# Altium schematic sheet QCLogic Rev A Sht1 MCU IO.SchDoc
size A3
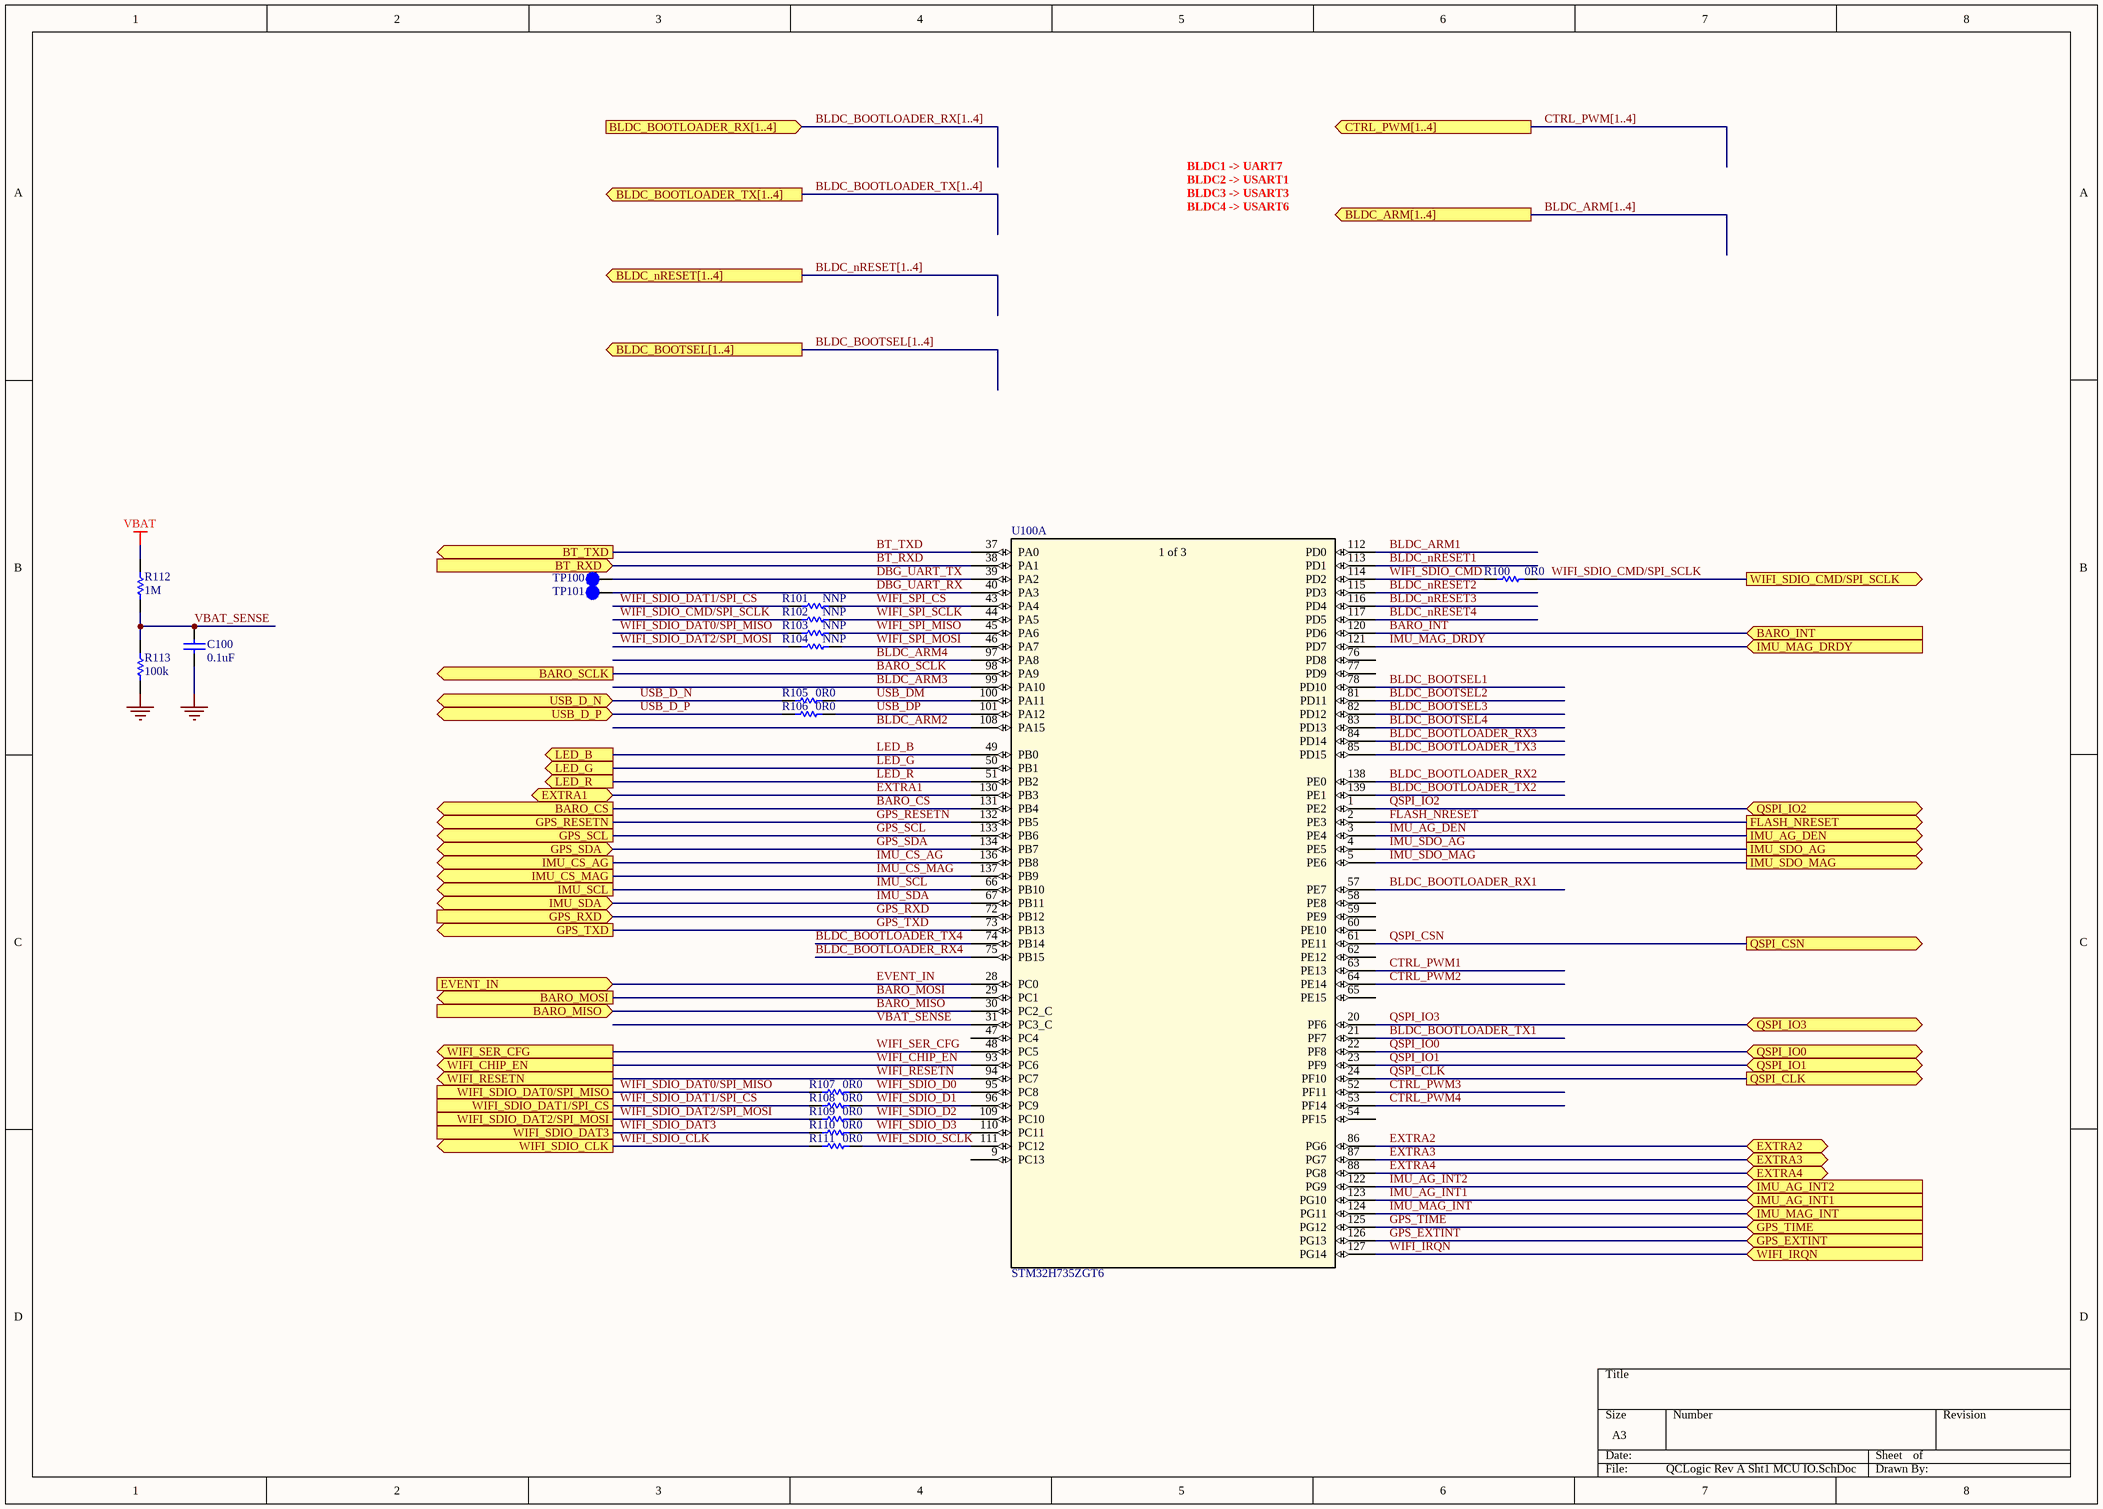
[diagram p0: QCLogic Rev A Sht1 MCU IO.SchDoc]

## Parts
C100  0.1uF  [SMD CAP 0402]
R100  0R0  [SMD RES 0402]
R101  NNP  [SMD RES 0402]  (no BOM)
R102  NNP  [SMD RES 0402]  (no BOM)
R103  NNP  [SMD RES 0402]  (no BOM)
R104  NNP  [SMD RES 0402]  (no BOM)
R105  0R0  [SMD RES 0402]
R106  0R0  [SMD RES 0402]
R107  0R0  [SMD RES 0402]
R108  0R0  [SMD RES 0402]
R109  0R0  [SMD RES 0402]
R110  0R0  [SMD RES 0402]
R111  0R0  [SMD RES 0402]
R112  1M  [SMD RES 0402]
R113  100k  [SMD RES 0402]
TP100  TESTPOINT SMD  [TESTPOINT 1mm DIA]  (value not drawn)  (no BOM)
TP101  TESTPOINT SMD  [TESTPOINT 1mm DIA]  (value not drawn)  (no BOM)
U100  STM32H735ZGT6  [LQFP-144 20x20]  (part A of 3)

## Ports
BARO_CS (out), BARO_INT (in), BARO_MISO (in), BARO_MOSI (out), BARO_SCLK (out), BLDC_ARM[1..4] (out), BLDC_BOOTLOADER_RX[1..4] (in), BLDC_BOOTLOADER_TX[1..4] (out), BLDC_BOOTSEL[1..4] (out), BLDC_nRESET[1..4] (out), BT_RXD (in), BT_TXD (out), CTRL_PWM[1..4] (out), EVENT_IN (in), EXTRA1 (bidir), EXTRA2 (bidir), EXTRA3 (bidir), EXTRA4 (bidir), FLASH_NRESET (out), GPS_EXTINT (in), GPS_RESETN (out), GPS_RXD (in), GPS_SCL (out), GPS_SDA (bidir), GPS_TIME (in), GPS_TXD (out), IMU_AG_DEN (out), IMU_AG_INT1 (in), IMU_AG_INT2 (in), IMU_CS_AG (out), IMU_CS_MAG (out), IMU_MAG_DRDY (in), IMU_MAG_INT (in), IMU_SCL (out), IMU_SDA (bidir), IMU_SDO_AG (out), IMU_SDO_MAG (out), LED_B (out), LED_G (out), LED_R (out), QSPI_CLK (out), QSPI_CSN (out), QSPI_IO0 (bidir), QSPI_IO1 (bidir), QSPI_IO2 (bidir), QSPI_IO3 (bidir), USB_D_N (bidir), USB_D_P (bidir), WIFI_CHIP_EN (out), WIFI_IRQN (in), WIFI_RESETN (out), WIFI_SDIO_CLK (out), WIFI_SDIO_CMD/SPI_SCLK (out), WIFI_SDIO_DAT0/SPI_MISO, WIFI_SDIO_DAT1/SPI_CS, WIFI_SDIO_DAT2/SPI_MOSI, WIFI_SDIO_DAT3, WIFI_SER_CFG (out)

## Nets
GND: C100.1 R113.2
VBAT: R112.1
BARO_CS: U100.131(PB4) ; port BARO_CS
BARO_INT: U100.120(PD6) ; port BARO_INT
BARO_MISO: U100.30(PC2_C) ; port BARO_MISO
BARO_MOSI: U100.29(PC1) ; port BARO_MOSI
BARO_SCLK: U100.98(PA9) ; port BARO_SCLK
BLDC_ARM1: U100.112(PD0)
BLDC_ARM2: U100.108(PA15)
BLDC_ARM3: U100.99(PA10)
BLDC_ARM4: U100.97(PA8)
BLDC_BOOTLOADER_RX1: U100.57(PE7)
BLDC_BOOTLOADER_RX2: U100.138(PE0)
BLDC_BOOTLOADER_RX3: U100.84(PD14)
BLDC_BOOTLOADER_RX4: U100.75(PB15)
BLDC_BOOTLOADER_TX1: U100.21(PF7)
BLDC_BOOTLOADER_TX2: U100.139(PE1)
BLDC_BOOTLOADER_TX3: U100.85(PD15)
BLDC_BOOTLOADER_TX4: U100.74(PB14)
BLDC_BOOTSEL1: U100.78(PD10)
BLDC_BOOTSEL2: U100.81(PD11)
BLDC_BOOTSEL3: U100.82(PD12)
BLDC_BOOTSEL4: U100.83(PD13)
BLDC_nRESET1: U100.113(PD1)
BLDC_nRESET2: U100.115(PD3)
BLDC_nRESET3: U100.116(PD4)
BLDC_nRESET4: U100.117(PD5)
BT_RXD: U100.38(PA1) ; port BT_RXD
BT_TXD: U100.37(PA0) ; port BT_TXD
CTRL_PWM1: U100.63(PE13)
CTRL_PWM2: U100.64(PE14)
CTRL_PWM3: U100.52(PF11)
CTRL_PWM4: U100.53(PF14)
DBG_UART_RX: TP101.1 U100.40(PA3)
DBG_UART_TX: TP100.1 U100.39(PA2)
EVENT_IN: U100.28(PC0) ; port EVENT_IN
EXTRA1: U100.130(PB3) ; port EXTRA1
EXTRA2: U100.86(PG6) ; port EXTRA2
EXTRA3: U100.87(PG7) ; port EXTRA3
EXTRA4: U100.88(PG8) ; port EXTRA4
FLASH_NRESET: U100.2(PE3) ; port FLASH_NRESET
GPS_EXTINT: U100.126(PG13) ; port GPS_EXTINT
GPS_RESETN: U100.132(PB5) ; port GPS_RESETN
GPS_RXD: U100.72(PB12) ; port GPS_RXD
GPS_SCL: U100.133(PB6) ; port GPS_SCL
GPS_SDA: U100.134(PB7) ; port GPS_SDA
GPS_TIME: U100.125(PG12) ; port GPS_TIME
GPS_TXD: U100.73(PB13) ; port GPS_TXD
IMU_AG_DEN: U100.3(PE4) ; port IMU_AG_DEN
IMU_AG_INT1: U100.123(PG10) ; port IMU_AG_INT1
IMU_AG_INT2: U100.122(PG9) ; port IMU_AG_INT2
IMU_CS_AG: U100.136(PB8) ; port IMU_CS_AG
IMU_CS_MAG: U100.137(PB9) ; port IMU_CS_MAG
IMU_MAG_DRDY: U100.121(PD7) ; port IMU_MAG_DRDY
IMU_MAG_INT: U100.124(PG11) ; port IMU_MAG_INT
IMU_SCL: U100.66(PB10) ; port IMU_SCL
IMU_SDA: U100.67(PB11) ; port IMU_SDA
IMU_SDO_AG: U100.4(PE5) ; port IMU_SDO_AG
IMU_SDO_MAG: U100.5(PE6) ; port IMU_SDO_MAG
LED_B: U100.49(PB0) ; port LED_B
LED_G: U100.50(PB1) ; port LED_G
LED_R: U100.51(PB2) ; port LED_R
QSPI_CLK: U100.24(PF10) ; port QSPI_CLK
QSPI_CSN: U100.61(PE11) ; port QSPI_CSN
QSPI_IO0: U100.22(PF8) ; port QSPI_IO0
QSPI_IO1: U100.23(PF9) ; port QSPI_IO1
QSPI_IO2: U100.1(PE2) ; port QSPI_IO2
QSPI_IO3: U100.20(PF6) ; port QSPI_IO3
USB_D_N: R105.1 ; port USB_D_N
USB_D_P: R106.1 ; port USB_D_P
USB_DM: R105.2 U100.100(PA11)
USB_DP: R106.2 U100.101(PA12)
VBAT_SENSE: C100.2 R112.2 R113.1 U100.31(PC3_C)
WIFI_CHIP_EN: U100.93(PC6) ; port WIFI_CHIP_EN
WIFI_IRQN: U100.127(PG14) ; port WIFI_IRQN
WIFI_RESETN: U100.94(PC7) ; port WIFI_RESETN
WIFI_SDIO_CLK: R111.1 ; port WIFI_SDIO_CLK
WIFI_SDIO_CMD: R100.2 U100.114(PD2)
WIFI_SDIO_CMD/SPI_SCLK: R100.1 R102.1 ; port WIFI_SDIO_CMD/SPI_SCLK
WIFI_SDIO_D0: R107.2 U100.95(PC8)
WIFI_SDIO_D1: R108.2 U100.96(PC9)
WIFI_SDIO_D2: R109.2 U100.109(PC10)
WIFI_SDIO_D3: R110.2 U100.110(PC11)
WIFI_SDIO_DAT0/SPI_MISO: R103.1 R107.1 ; port WIFI_SDIO_DAT0/SPI_MISO
WIFI_SDIO_DAT1/SPI_CS: R101.2 R108.1 ; port WIFI_SDIO_DAT1/SPI_CS
WIFI_SDIO_DAT2/SPI_MOSI: R104.1 R109.1 ; port WIFI_SDIO_DAT2/SPI_MOSI
WIFI_SDIO_DAT3: R110.1 ; port WIFI_SDIO_DAT3
WIFI_SDIO_SCLK: R111.2 U100.111(PC12)
WIFI_SER_CFG: U100.48(PC5) ; port WIFI_SER_CFG
WIFI_SPI_CS: R101.1 U100.43(PA4)
WIFI_SPI_MISO: R103.2 U100.45(PA6)
WIFI_SPI_MOSI: R104.2 U100.46(PA7)
WIFI_SPI_SCLK: R102.2 U100.44(PA5)

Not connected (* = marked no-connect by the designer): U100 9(PC13) 47(PC4) 54(PF15) 58(PE8) 59(PE9) 60(PE10) 62(PE12) 65(PE15) 76(PD8) 77(PD9)

## Buses and harness runs
bus BLDC_ARM[1..4] = port BLDC_ARM[1..4]
bus BLDC_BOOTLOADER_RX[1..4] = port BLDC_BOOTLOADER_RX[1..4]
bus BLDC_BOOTLOADER_TX[1..4] = port BLDC_BOOTLOADER_TX[1..4]
bus BLDC_BOOTSEL[1..4] = port BLDC_BOOTSEL[1..4]
bus BLDC_nRESET[1..4] = port BLDC_nRESET[1..4]
bus CTRL_PWM[1..4] = port CTRL_PWM[1..4]

## Notes on the sheet
- BLDC1 -> UART7
- BLDC2 -> USART1
- BLDC3 -> USART3
- BLDC4 -> USART6
- (in symbol IC MCU STM32H735ZG Arm M7, part A) 1 of 3

## Library data of the parts
C100 = CAP MLCC SMD: CAP CER 0.1UF 25V X7R 0402; 1. Manufacturer: Yageo; 2. Manufacturer Part Number: CC0402KRX7R8BB104; 4. Package: 0402; 3. Date Modified: 20201122
R100-R111 = RES SMD: RES SMD 0 OHM JUMPER 1/16W 0402; 1. Manufacturer: Yageo; 2. Manufacturer Part Number: RC0402FR-070RL; 4. Package: 0402; 3. Date Modified: 20201122
R112 = RES SMD: RES SMD 1M OHM 1% 1/16W 0402; 1. Manufacturer: Yageo; 2. Manufacturer Part Number: RC0402FR-071ML; 4. Package: 0402; 3. Date Modified: 20201127
R113 = RES SMD: RES SMD 100K OHM 1% 1/16W 0402; 1. Manufacturer: Yageo; 2. Manufacturer Part Number: RC0402FR-07100KL; 4. Package: 0402; 3. Date Modified: 20201126
TP100 TP101 = TESTPOINT PAD: TESTPOINT SMD PAD; 1. Manufacturer: *; 2. Manufacturer Part Number: *; 3. Date Modified: *
U100 = IC MCU STM32H735ZG Arm M7: ARM® Cortex®-M7 STM32H7 Microcontroller IC 32-Bit 550MHz 1MB (1M x 8) FLASH 144 LQFP 20x20; 1. Manufacturer: STMicroelectronics; 2. Manufacturer Part Number: STM32H735ZGT6; 3. Date Modified: 20201126